# Altium schematic sheet 07_FMC_LPC_Interface.SchDoc
size A3
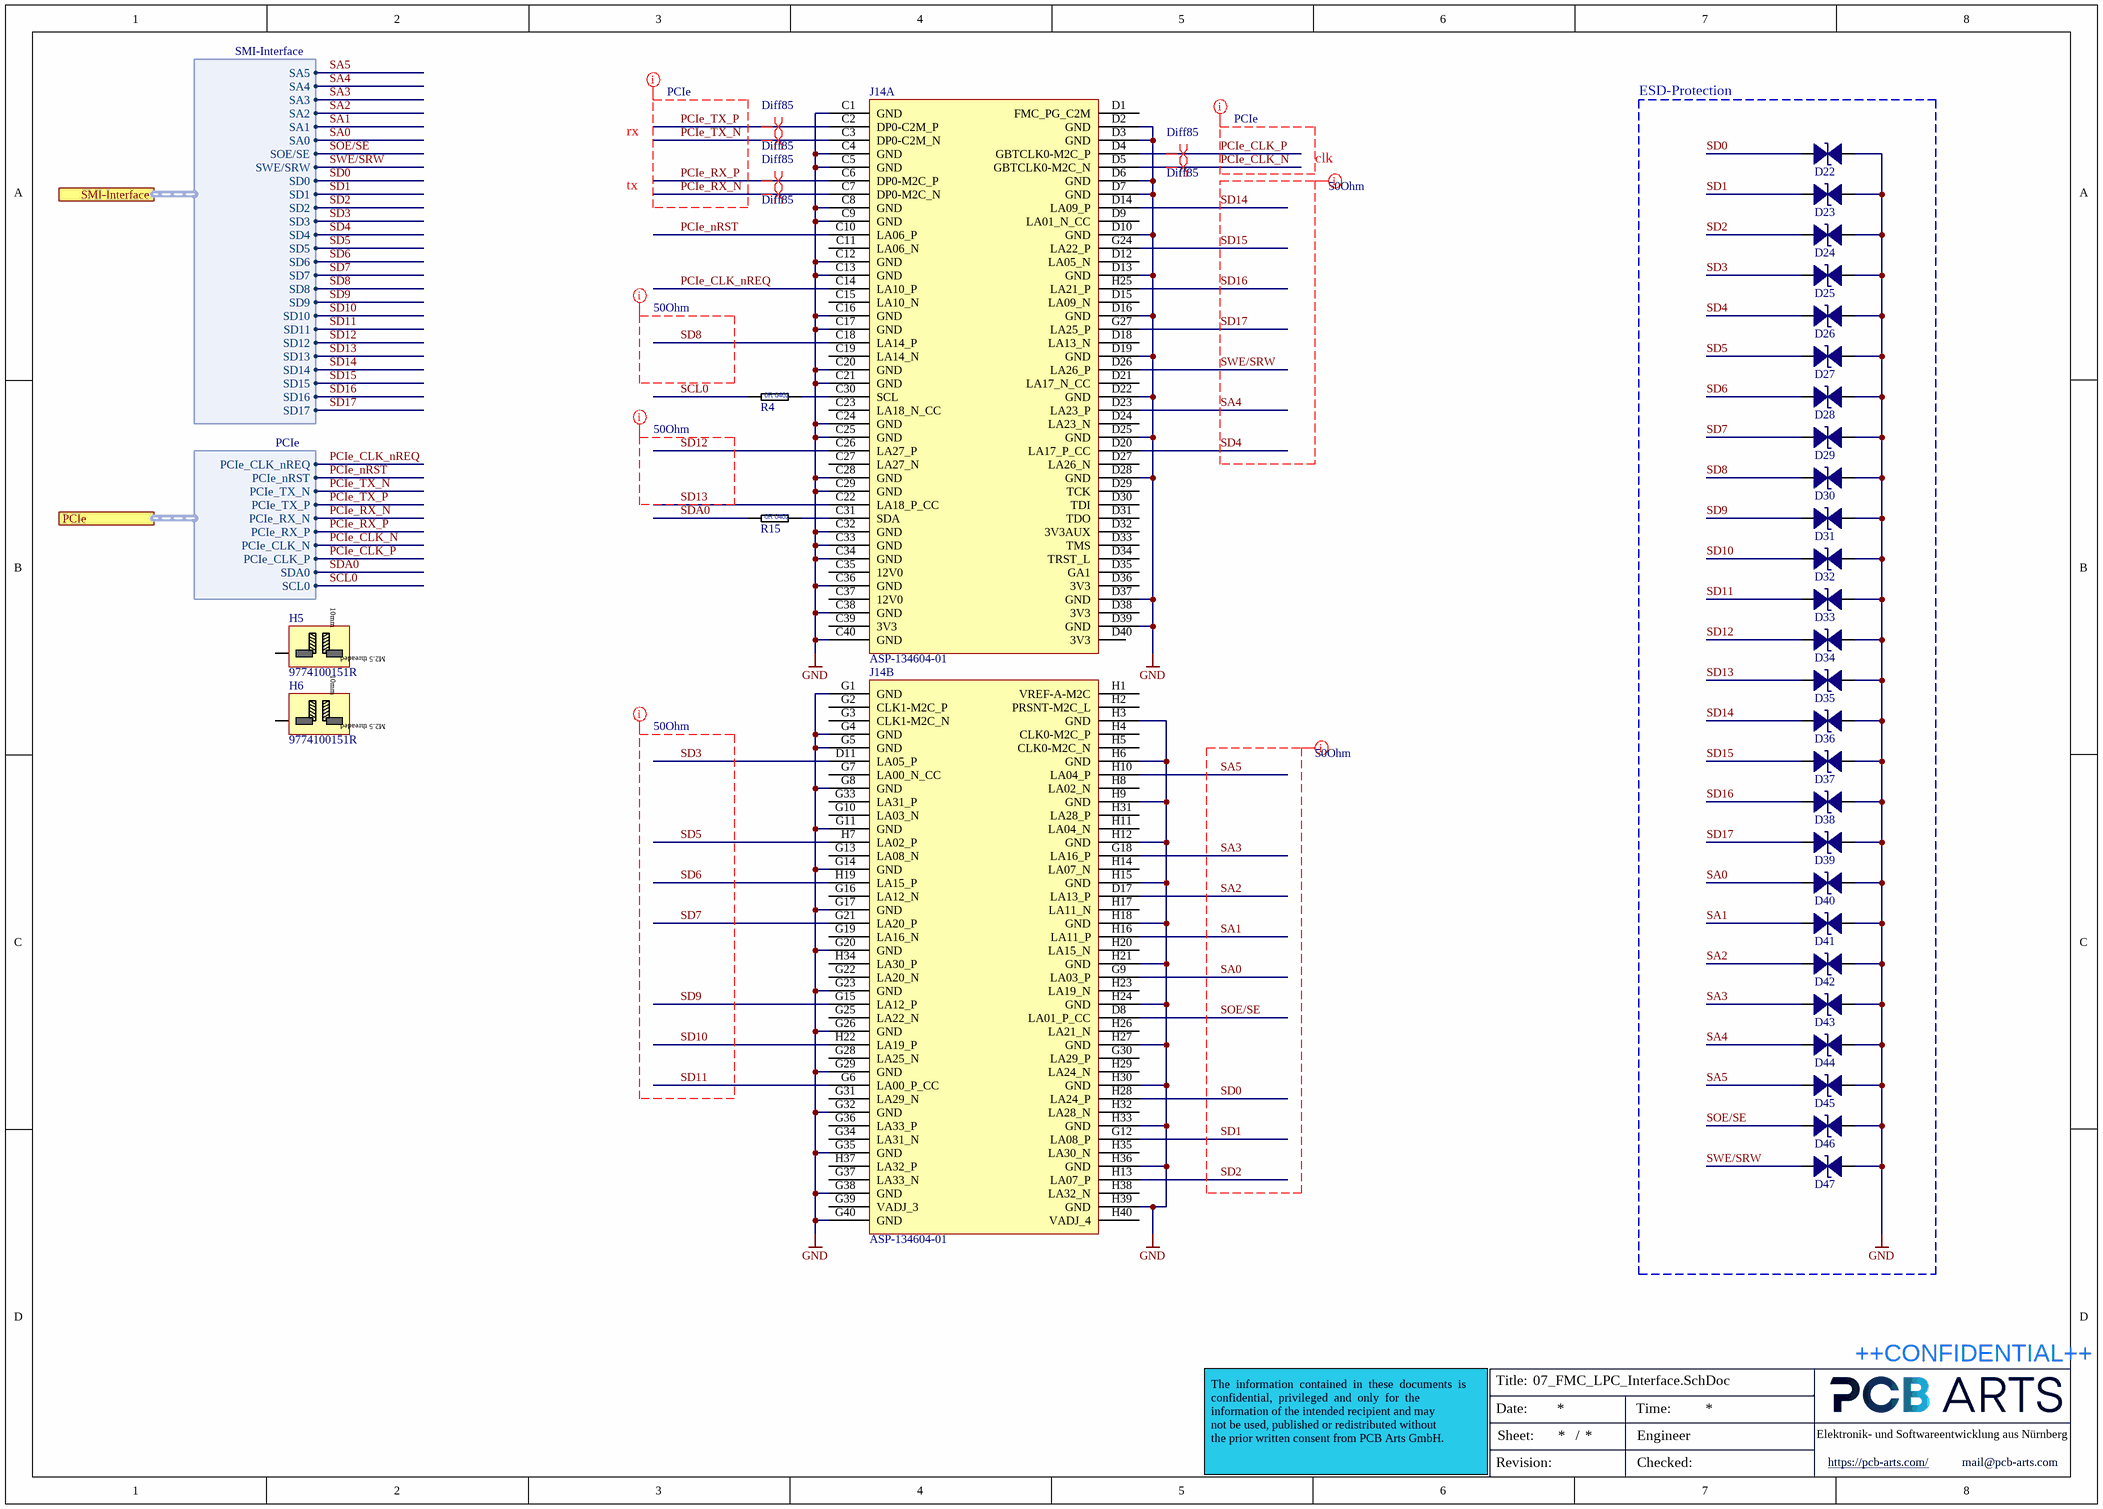
[diagram p0: 07_FMC_LPC_Interface.SchDoc]

## Parts
D22  CESDP0402UC5VB  [TVS_0402]  (value not drawn)
D23  CESDP0402UC5VB  [TVS_0402]  (value not drawn)
D24  CESDP0402UC5VB  [TVS_0402]  (value not drawn)
D25  CESDP0402UC5VB  [TVS_0402]  (value not drawn)
D26  CESDP0402UC5VB  [TVS_0402]  (value not drawn)
D27  CESDP0402UC5VB  [TVS_0402]  (value not drawn)
D28  CESDP0402UC5VB  [TVS_0402]  (value not drawn)
D29  CESDP0402UC5VB  [TVS_0402]  (value not drawn)
D30  CESDP0402UC5VB  [TVS_0402]  (value not drawn)
D31  CESDP0402UC5VB  [TVS_0402]  (value not drawn)
D32  CESDP0402UC5VB  [TVS_0402]  (value not drawn)
D33  CESDP0402UC5VB  [TVS_0402]  (value not drawn)
D34  CESDP0402UC5VB  [TVS_0402]  (value not drawn)
D35  CESDP0402UC5VB  [TVS_0402]  (value not drawn)
D36  CESDP0402UC5VB  [TVS_0402]  (value not drawn)
D37  CESDP0402UC5VB  [TVS_0402]  (value not drawn)
D38  CESDP0402UC5VB  [TVS_0402]  (value not drawn)
D39  CESDP0402UC5VB  [TVS_0402]  (value not drawn)
D40  CESDP0402UC5VB  [TVS_0402]  (value not drawn)
D41  CESDP0402UC5VB  [TVS_0402]  (value not drawn)
D42  CESDP0402UC5VB  [TVS_0402]  (value not drawn)
D43  CESDP0402UC5VB  [TVS_0402]  (value not drawn)
D44  CESDP0402UC5VB  [TVS_0402]  (value not drawn)
D45  CESDP0402UC5VB  [TVS_0402]  (value not drawn)
D46  CESDP0402UC5VB  [TVS_0402]  (value not drawn)
D47  CESDP0402UC5VB  [TVS_0402]  (value not drawn)
H5  9774100151R  [9774100151R]
H6  9774100151R  [9774100151R]
J14  ASP-134604-01  [ASP-134604-01]  (parts A,B of 2)
R4  0R Jumper  [RES_0402]  (value not drawn)
R15  0R Jumper  [RES_0402]  (value not drawn)

## Blocks framed on the sheet
ESD-Protection: D22-D47

## Ports
PCIe (harness PCIe), SMI-Interface (harness SMI-Interface)

## Harnesses
SMI-Interface: SA5, SA4, SA3, SA2, SA1, SA0, SOE/SE, SWE/SRW, SD0, SD1, SD2, SD3, SD4, SD5, SD6, SD7, SD8, SD9, SD10, SD11, SD12, SD13, SD14, SD15, SD16, SD17
PCIe: PCIe_CLK_nREQ, PCIe_nRST, PCIe_TX_N, PCIe_TX_P, PCIe_RX_N, PCIe_RX_P, PCIe_CLK_N, PCIe_CLK_P, SDA0, SCL0

## Nets
GND: D22.2 D23.2 D24.2 D25.2 D26.2 D27.2 D28.2 D29.2 D30.2 D31.2 D32.2 D33.2 D34.2 D35.2 D36.2 D37.2 D38.2 D39.2 D40.2 D41.2 D42.2 D43.2 D44.2 D45.2 D46.2 D47.2 J14.C1(GND) J14.C4(GND) J14.C5(GND) J14.C8(GND) J14.C9(GND) J14.C12(GND) J14.C13(GND) J14.C16(GND) J14.C17(GND) J14.C20(GND) J14.C21(GND) J14.C24(GND) J14.C25(GND) J14.C28(GND) J14.C29(GND) J14.C32(GND) J14.C33(GND) J14.C34(GND) J14.C36(GND) J14.C38(GND) J14.C40(GND) J14.D2(GND) J14.D3(GND) J14.D6(GND) J14.D7(GND) J14.D10(GND) J14.D13(GND) J14.D16(GND) J14.D19(GND) J14.D22(GND) J14.D25(GND) J14.D28(GND) J14.D37(GND) J14.D39(GND) J14.G1(GND) J14.G4(GND) J14.G5(GND) J14.G8(GND) J14.G11(GND) J14.G14(GND) J14.G17(GND) J14.G20(GND) J14.G23(GND) J14.G26(GND) J14.G29(GND) J14.G32(GND) J14.G35(GND) J14.G38(GND) J14.G40(GND) J14.H3(GND) J14.H6(GND) J14.H9(GND) J14.H12(GND) J14.H15(GND) J14.H18(GND) J14.H21(GND) J14.H24(GND) J14.H27(GND) J14.H30(GND) J14.H33(GND) J14.H36(GND) J14.H39(GND)
PCIe_CLK_N: J14.D5(GBTCLK0-M2C_N) ; port PCIe.PCIe_CLK_N
PCIe_CLK_nREQ: J14.C14(LA10_P) ; port PCIe.PCIe_CLK_nREQ
PCIe_CLK_P: J14.D4(GBTCLK0-M2C_P) ; port PCIe.PCIe_CLK_P
PCIe_nRST: J14.C10(LA06_P) ; port PCIe.PCIe_nRST
PCIe_RX_N: J14.C7(DP0-M2C_N) ; port PCIe.PCIe_RX_N
PCIe_RX_P: J14.C6(DP0-M2C_P) ; port PCIe.PCIe_RX_P
PCIe_TX_N: J14.C3(DP0-C2M_N) ; port PCIe.PCIe_TX_N
PCIe_TX_P: J14.C2(DP0-C2M_P) ; port PCIe.PCIe_TX_P
SA0: D40.1 J14.G9(LA03_P) ; port SMI-Interface.SA0
SA1: D41.1 J14.H16(LA11_P) ; port SMI-Interface.SA1
SA2: D42.1 J14.D17(LA13_P) ; port SMI-Interface.SA2
SA3: D43.1 J14.G18(LA16_P) ; port SMI-Interface.SA3
SA4: D44.1 J14.D23(LA23_P) ; port SMI-Interface.SA4
SA5: D45.1 J14.H10(LA04_P) ; port SMI-Interface.SA5
SCL0: R4.1 ; port PCIe.SCL0
SD0: D22.1 J14.H28(LA24_P) ; port SMI-Interface.SD0
SD1: D23.1 J14.G12(LA08_P) ; port SMI-Interface.SD1
SD2: D24.1 J14.H13(LA07_P) ; port SMI-Interface.SD2
SD3: D25.1 J14.D11(LA05_P) ; port SMI-Interface.SD3
SD4: D26.1 J14.D20(LA17_P_CC) ; port SMI-Interface.SD4
SD5: D27.1 J14.H7(LA02_P) ; port SMI-Interface.SD5
SD6: D28.1 J14.H19(LA15_P) ; port SMI-Interface.SD6
SD7: D29.1 J14.G21(LA20_P) ; port SMI-Interface.SD7
SD8: D30.1 J14.C18(LA14_P) ; port SMI-Interface.SD8
SD9: D31.1 J14.G15(LA12_P) ; port SMI-Interface.SD9
SD10: D32.1 J14.H22(LA19_P) ; port SMI-Interface.SD10
SD11: D33.1 J14.G6(LA00_P_CC) ; port SMI-Interface.SD11
SD12: D34.1 J14.C26(LA27_P) ; port SMI-Interface.SD12
SD13: D35.1 J14.C22(LA18_P_CC) ; port SMI-Interface.SD13
SD14: D36.1 J14.D14(LA09_P) ; port SMI-Interface.SD14
SD15: D37.1 J14.G24(LA22_P) ; port SMI-Interface.SD15
SD16: D38.1 J14.H25(LA21_P) ; port SMI-Interface.SD16
SD17: D39.1 J14.G27(LA25_P) ; port SMI-Interface.SD17
SDA0: R15.1 ; port PCIe.SDA0
SOE/SE: D46.1 J14.D8(LA01_P_CC) ; port SMI-Interface.SOE/SE
SWE/SRW: D47.1 J14.D26(LA26_P) ; port SMI-Interface.SWE/SRW
NetJ14_C30: J14.C30(SCL) R4.2
NetJ14_C31: J14.C31(SDA) R15.2

Not connected (* = marked no-connect by the designer): H5 1; H6 1; J14 C11(LA06_N) C15(LA10_N) C19(LA14_N) C23(LA18_N_CC) C27(LA27_N) C35(12V0) C37(12V0) C39(3V3) D1(FMC_PG_C2M) D9(LA01_N_CC) D12(LA05_N) D15(LA09_N) D18(LA13_N) D21(LA17_N_CC) D24(LA23_N) D27(LA26_N) D29(TCK) D30(TDI) D31(TDO) D32(3V3AUX) D33(TMS) D34(TRST_L) D35(GA1) D36(3V3) D38(3V3) D40(3V3) G2(CLK1-M2C_P) G3(CLK1-M2C_N) G7(LA00_N_CC) G10(LA03_N) G13(LA08_N) G16(LA12_N) G19(LA16_N) G22(LA20_N) G25(LA22_N) G28(LA25_N) G30(LA29_P) G31(LA29_N) G33(LA31_P) G34(LA31_N) G36(LA33_P) G37(LA33_N) G39(VADJ_3) H1(VREF-A-M2C) H2(PRSNT-M2C_L) H4(CLK0-M2C_P) H5(CLK0-M2C_N) H8(LA02_N) H11(LA04_N) H14(LA07_N) H17(LA11_N) H20(LA15_N) H23(LA19_N) H26(LA21_N) H29(LA24_N) H31(LA28_P) H32(LA28_N) H34(LA30_P) H35(LA30_N) H37(LA32_P) H38(LA32_N) H40(VADJ_4)

## Layout directives
net class 50Ohm: SA0, SA1, SA2, SA3, SA4, SA5, SD0, SD1, SD2, SD3, SD4, SD5, SD6, SD7, SD8, SD9, SD10, SD11, SD12, SD13, SD14, SD15, SD16, SD17, SOE/SE, SWE/SRW
differential pair; net class Diff85: PCIe_CLK_N, PCIe_CLK_P, PCIe_RX_N, PCIe_RX_P, PCIe_TX_N, PCIe_TX_P
net class PCIe: PCIe_CLK_N, PCIe_CLK_P, PCIe_RX_N, PCIe_RX_P, PCIe_TX_N, PCIe_TX_P

## Notes on the sheet
- rx
- clk
- tx
- Title:
- ++CONFIDENTIAL++
- Date:
- Sheet:
- /
- Time:
- Engineer
- Elektronik- und Softwareentwicklung aus Nürnberg
- The  information  contained  in  these  documents  is  confidential,  privileged  and  only  for  the
  information of the intended recipient and may
  not be used, published or redistributed without
  the prior written consent from PCB Arts GmbH.
- Revision:
- Checked:
- https://pcb-arts.com/
- mail@pcb-arts.com
- (in symbol RES_0402_0R Jumper) 0R 0402
- (in symbol Würth Standoff M2.5 h:5mm_1) 10mm; M2.5 threaded

## Library data of the parts
D22-D47 = CESDP0402UC5VB_TVS Diode 0402: Low Capacitance ESD Protection Diode 0402; Manufacturer 1: CREATEK; Manufacturer 2 Prt. Nr.: BPESD0402-05ST; Manufacturer 1 Prt. Nr.: CESDP0402UC5VB; Manufacturer 2: BORN
H5 H6 = Würth Standoff M2.5 h:5mm_1: Würth Standoff M2.5 h:10mm 9774050151R; Manufacturer 1: Würth Elektronik; Manufacturer 1 Prt. Nr.: 9774100151R
J14 = ASP-134604-01_Female FMC-Connector mating plug: Female FMC-Connector mating plug; Manufacturer 1: Samtec; Manufacturer 1 Prt. Nr.: ASP-134604-01
R4 R15 = RES_0402_0R Jumper: Thick Film Resistors - SMD 0Ohm; Manufacturer 1: Vishay / Dale; Manufacturer 1 Prt. Nr.: CRCW04020000Z0EDC; Manufacturer 2 Prt. Nr.: RC0402JR-070RL; Manufacturer 2: Yageo